# Altium schematic sheet RMS_to_DC_1.SchDoc: RMS_to_DC
size A4; ApprovedBy: 阳光电路; CheckedBy: 阳光电路; Author: 阳光电路; CompanyName: 阳光电路; DrawnBy: 阳光电路; Engineer: 阳光电路; Organization: 阳光电路; Address1: 中国; Address2: 桂林; Address3: 阳朔; Address4: 中国 2021; DocumentNumber: 1; Revision: Rev 1.1.0; SheetNumber: 1; SheetTotal: 1
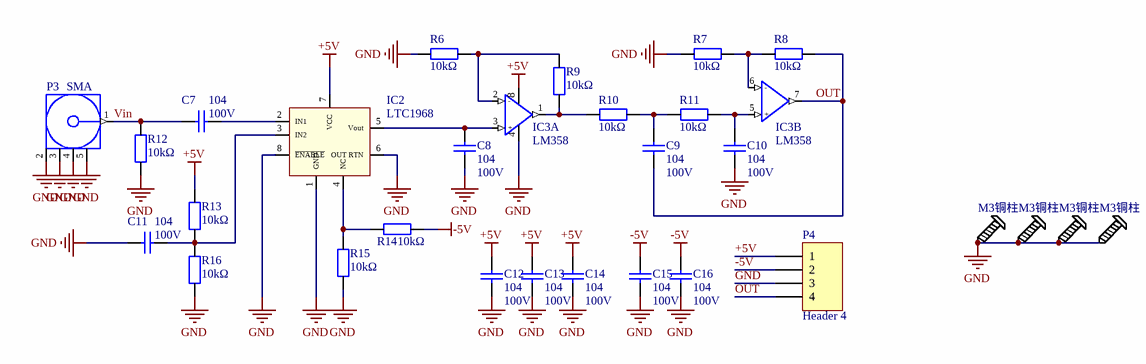
[diagram p0: RMS_to_DC_1.SchDoc]

## Parts
C7  voltage: 100V  [C0603]  (hidden comment: 叠层陶瓷电容)
C8  voltage: 100V  [C0603]  (hidden comment: 叠层陶瓷电容)
C9  voltage: 100V  [C0603]  (hidden comment: 叠层陶瓷电容)
C10  voltage: 100V  [C0603]  (hidden comment: 叠层陶瓷电容)
C11  voltage: 100V  [C0603]  (hidden comment: 叠层陶瓷电容)
C12  voltage: 100V  [C0603]  (hidden comment: 叠层陶瓷电容)
C13  voltage: 100V  [C0603]  (hidden comment: 叠层陶瓷电容)
C14  voltage: 100V  [C0603]  (hidden comment: 叠层陶瓷电容)
C15  voltage: 100V  [C0603]  (hidden comment: 叠层陶瓷电容)
C16  voltage: 100V  [C0603]  (hidden comment: 叠层陶瓷电容)
IC2  LTC1968  [MSOP-8]
IC3  LM358  [SOP-8(体宽3.8mm)]  (parts A,B of 2)
P3  SMA  [SMA-夹板]
P4  Header 4  [HDR1X4]
R6  贴片电阻  [R0603]  (value not drawn)
R7  贴片电阻  [R0603]  (value not drawn)
R8  贴片电阻  [R0603]  (value not drawn)
R9  贴片电阻  [R0603]  (value not drawn)
R10  贴片电阻  [R0603]  (value not drawn)
R11  贴片电阻  [R0603]  (value not drawn)
R12  贴片电阻  [R0603]  (value not drawn)
R13  贴片电阻  [R0603]  (value not drawn)
R14  贴片电阻  [R0603]  (value not drawn)
R15  贴片电阻  [R0603]  (value not drawn)
R16  贴片电阻  [R0603]  (value not drawn)
S5  M3铜柱  [M3]
S6  M3铜柱  [M3]
S7  M3铜柱  [M3]
S8  M3铜柱  [M3]

## Nets
+5V: C12.2 C13.2 C14.2 IC2.7(VCC) IC3.8(vcc) P4.1 R13.2
-5V: C15.2 C16.2 P4.2 R14.1
GND: C8.1 C10.1 C11.1 C12.1 C13.1 C14.1 C15.1 C16.1 IC2.1(GND) IC2.6(OUT_RTN) IC2.8(~{ENABLE}) IC3.4(vee) P3.2 P3.3 P3.4 P3.5 P4.3 R6.1 R7.1 R12.1 R15.1 R16.1 S5.1(GND) S6.1(GND) S7.1(GND) S8.1(GND)
OUT: C9.1 IC3.7(out) P4.4 R8.2
Vin: C7.1 P3.1 R12.2
NetC7_2: C7.2 IC2.2(IN1)
NetC8_2: C8.2 IC2.5(Vout) IC3.3(+)
NetC9_2: C9.2 R10.1 R11.2
NetC10_2: C10.2 IC3.5(+) R11.1
NetC11_2: C11.2 IC2.3(IN2) R13.1 R16.2
NetIC2_4: IC2.4(NC) R14.2 R15.2
NetIC3_1: IC3.1(out) R9.2 R10.2
NetIC3_2: IC3.2(-) R6.2 R9.1
NetIC3_6: IC3.6(-) R7.2 R8.1

## Notes on the sheet
- Title
- DrawnBy:
- Size:
- Date:
- A4
- Number:
- Time:
- Revision:
- Sheet
- of
- File:

## Library data of the parts
C7-C16 = 104: 无极性电容; type: 0805; capacity: 104
IC2 = LTC1968: RMS
IC3 = LM358: 运放; package: SOP-8; type: LM358
P3 = SMA: 射频座
P4 = Header 4: Header, 4-Pin; LatestRevisionDate: 17-Jul-2002; LatestRevisionNote: Re-released for DXP Platform.; Publisher: Altium Limited
R6-R16 = 10kΩ: 贴片/直插电阻; package: 0805; resistance: 10kΩ